# Altium schematic sheet IrSensor.SchDoc
size A4; Organization: Altium Limited; Address1: L3, 12a Rodborough Rd; Address2: Frenchs Forest; Address3: NSW; Address4: Australia 2086
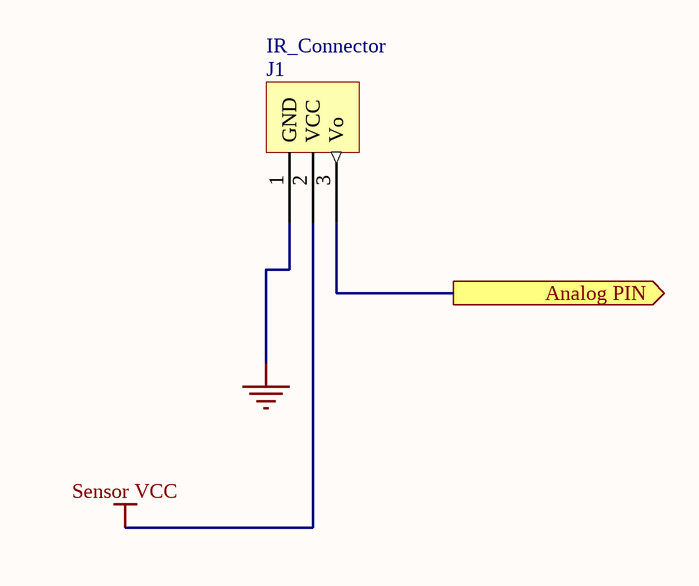
[diagram p0: IrSensor.SchDoc]

## Parts
J1  IR_Connector  [IR SENSOR CONNECTOR]

## Ports
Analog PIN (out)

## Nets
GND: J1.1(GND)
Sensor VCC: J1.2(VCC)
Analog PIN: J1.3(Vo) ; port Analog PIN

## Notes on the sheet
- Title
- Size:
- Date:
- A4
- Number:
- Time:
- Revision:
- Sheet
- of
- File:

## Library data of the parts
J1 = IR_Connector: Female Embase 3 contacts; fournisseur: Farnell; reffournisseur: 1845931; fabricant: TE CONNECTIVITY / AMP; reffabricant: 5-534237-1